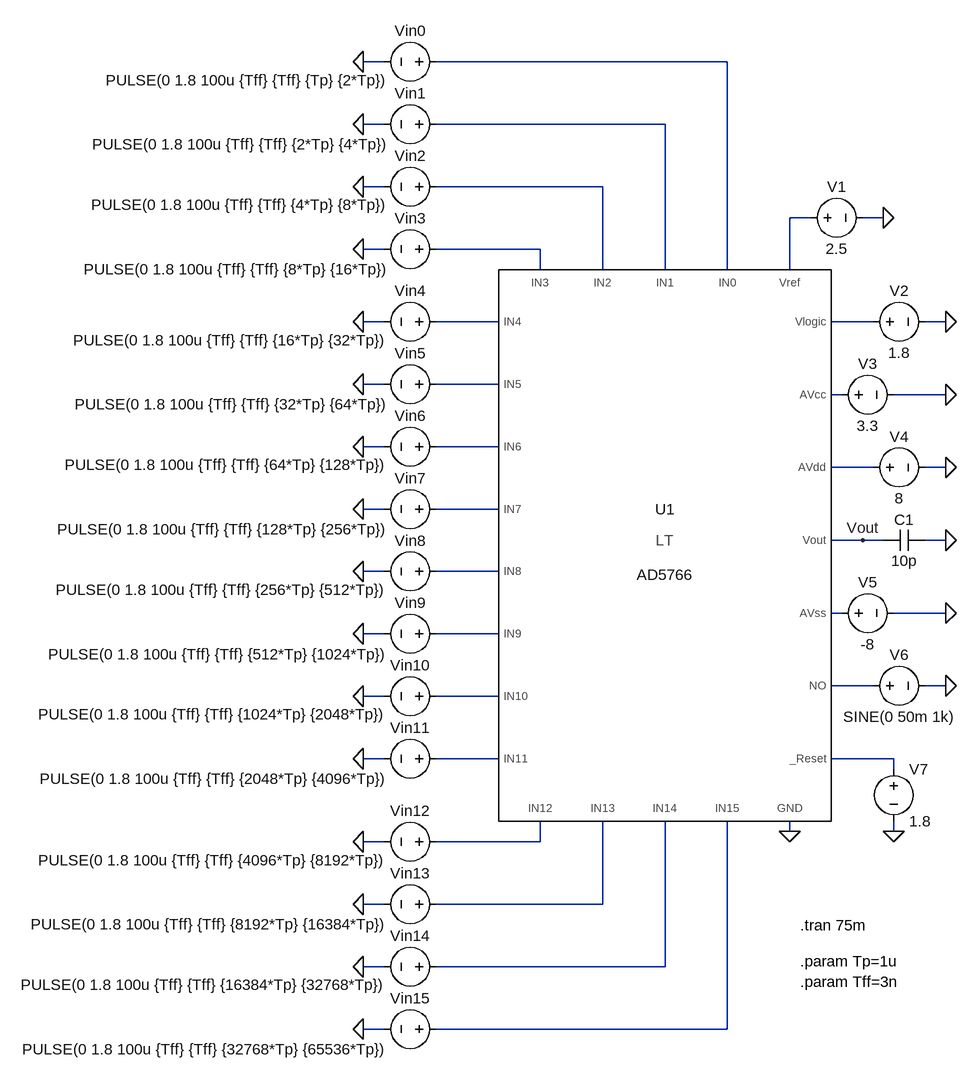
[diagram p0: schematic AD5766.asc]
AD5766.asc, the LTspice schematic file:
Version 4
SHEET 1 2580 1392
WIRE -128 -144 -160 -144
WIRE 400 -144 -48 -144
WIRE -128 -48 -160 -48
WIRE 304 -48 -48 -48
WIRE -128 48 -160 48
WIRE 208 48 -48 48
WIRE 528 96 496 96
WIRE 640 96 608 96
WIRE -128 144 -160 144
WIRE 112 144 -48 144
WIRE 112 176 112 144
WIRE 208 176 208 48
WIRE 304 176 304 -48
WIRE 400 176 400 -144
WIRE 496 176 496 96
WIRE -128 256 -160 256
WIRE 48 256 -48 256
WIRE 624 256 560 256
WIRE 736 256 704 256
WIRE -128 352 -160 352
WIRE 48 352 -48 352
WIRE 576 368 560 368
WIRE 736 368 656 368
WIRE -128 448 -160 448
WIRE 48 448 -48 448
WIRE 624 480 560 480
WIRE 736 480 704 480
WIRE -128 544 -160 544
WIRE 48 544 -48 544
WIRE 608 592 560 592
WIRE 640 592 608 592
WIRE 736 592 704 592
WIRE -128 640 -160 640
WIRE 48 640 -48 640
WIRE 576 704 560 704
WIRE 736 704 656 704
WIRE -128 736 -160 736
WIRE 48 736 -48 736
WIRE 624 816 560 816
WIRE 736 816 704 816
WIRE -128 832 -160 832
WIRE 48 832 -48 832
WIRE -128 928 -160 928
WIRE 48 928 -48 928
WIRE 656 928 560 928
WIRE 656 944 656 928
WIRE 496 1040 496 1024
WIRE 656 1040 656 1024
WIRE -128 1056 -160 1056
WIRE 112 1056 112 1024
WIRE 112 1056 -48 1056
WIRE -128 1152 -160 1152
WIRE 208 1152 208 1024
WIRE 208 1152 -48 1152
WIRE -128 1248 -160 1248
WIRE 304 1248 304 1024
WIRE 304 1248 -48 1248
WIRE -128 1344 -160 1344
WIRE 400 1344 400 1024
WIRE 400 1344 -48 1344
FLAG 496 1040 0
FLAG 640 96 0
FLAG 736 256 0
FLAG -160 -144 0
FLAG 736 592 0
FLAG 608 592 Vout
FLAG -160 -48 0
FLAG -160 48 0
FLAG -160 144 0
FLAG -160 256 0
FLAG -160 352 0
FLAG -160 448 0
FLAG -160 544 0
FLAG -160 640 0
FLAG -160 736 0
FLAG -160 832 0
FLAG -160 928 0
FLAG -160 1056 0
FLAG -160 1152 0
FLAG -160 1248 0
FLAG -160 1344 0
FLAG 736 368 0
FLAG 736 480 0
FLAG 736 704 0
FLAG 736 816 0
FLAG 656 1040 0
SYMBOL voltage 512 96 M90
WINDOW 0 -32 56 VBottom 2
WINDOW 3 32 56 VTop 2
WINDOW 123 74 56 VTop 2
WINDOW 39 53 56 VTop 2
SYMATTR InstName V1
SYMATTR Value 2.5
SYMBOL voltage 608 256 M90
WINDOW 0 -32 56 VBottom 2
WINDOW 3 32 56 VTop 2
WINDOW 123 74 56 VTop 2
WINDOW 39 53 56 VTop 2
SYMATTR InstName V2
SYMATTR Value 1.8
SYMBOL voltage -32 -144 R90
WINDOW 0 -32 56 VBottom 2
WINDOW 3 28 86 VRight 2
SYMATTR InstName Vin0
SYMATTR Value PULSE(0 1.8 100u {Tff} {Tff} {Tp} {2*Tp})
SYMBOL cap 704 576 R90
WINDOW 0 0 32 VBottom 2
WINDOW 3 32 32 VTop 2
SYMATTR InstName C1
SYMATTR Value 10p
SYMBOL AD5766 304 592 R0
SYMATTR InstName U1
SYMBOL voltage -32 -48 R90
WINDOW 0 -32 56 VBottom 2
WINDOW 3 31 84 VRight 2
SYMATTR InstName Vin1
SYMATTR Value PULSE(0 1.8 100u {Tff} {Tff} {2*Tp} {4*Tp})
SYMBOL voltage -32 48 R90
WINDOW 0 -32 56 VBottom 2
WINDOW 3 28 86 VRight 2
SYMATTR InstName Vin2
SYMATTR Value PULSE(0 1.8 100u {Tff} {Tff} {4*Tp} {8*Tp})
SYMBOL voltage -32 144 R90
WINDOW 0 -32 56 VBottom 2
WINDOW 3 31 84 VRight 2
SYMATTR InstName Vin3
SYMATTR Value PULSE(0 1.8 100u {Tff} {Tff} {8*Tp} {16*Tp})
SYMBOL voltage -32 256 R90
WINDOW 0 -32 56 VBottom 2
WINDOW 3 28 86 VRight 2
SYMATTR InstName Vin4
SYMATTR Value PULSE(0 1.8 100u {Tff} {Tff} {16*Tp} {32*Tp})
SYMBOL voltage -32 352 R90
WINDOW 0 -32 56 VBottom 2
WINDOW 3 31 84 VRight 2
SYMATTR InstName Vin5
SYMATTR Value PULSE(0 1.8 100u {Tff} {Tff} {32*Tp} {64*Tp})
SYMBOL voltage -32 448 R90
WINDOW 0 -32 56 VBottom 2
WINDOW 3 28 86 VRight 2
SYMATTR InstName Vin6
SYMATTR Value PULSE(0 1.8 100u {Tff} {Tff} {64*Tp} {128*Tp})
SYMBOL voltage -32 544 R90
WINDOW 0 -32 56 VBottom 2
WINDOW 3 31 84 VRight 2
SYMATTR InstName Vin7
SYMATTR Value PULSE(0 1.8 100u {Tff} {Tff} {128*Tp} {256*Tp})
SYMBOL voltage -32 640 R90
WINDOW 0 -32 56 VBottom 2
WINDOW 3 28 86 VRight 2
SYMATTR InstName Vin8
SYMATTR Value PULSE(0 1.8 100u {Tff} {Tff} {256*Tp} {512*Tp})
SYMBOL voltage -32 736 R90
WINDOW 0 -32 56 VBottom 2
WINDOW 3 31 84 VRight 2
SYMATTR InstName Vin9
SYMATTR Value PULSE(0 1.8 100u {Tff} {Tff} {512*Tp} {1024*Tp})
SYMBOL voltage -32 832 R90
WINDOW 0 -32 56 VBottom 2
WINDOW 3 28 86 VRight 2
SYMATTR InstName Vin10
SYMATTR Value PULSE(0 1.8 100u {Tff} {Tff} {1024*Tp} {2048*Tp})
SYMBOL voltage -32 928 R90
WINDOW 0 -32 56 VBottom 2
WINDOW 3 31 84 VRight 2
SYMATTR InstName Vin11
SYMATTR Value PULSE(0 1.8 100u {Tff} {Tff} {2048*Tp} {4096*Tp})
SYMBOL voltage -32 1056 R90
WINDOW 0 -32 56 VBottom 2
WINDOW 3 28 86 VRight 2
SYMATTR InstName Vin12
SYMATTR Value PULSE(0 1.8 100u {Tff} {Tff} {4096*Tp} {8192*Tp})
SYMBOL voltage -32 1152 R90
WINDOW 0 -32 56 VBottom 2
WINDOW 3 31 84 VRight 2
SYMATTR InstName Vin13
SYMATTR Value PULSE(0 1.8 100u {Tff} {Tff} {8192*Tp} {16384*Tp})
SYMBOL voltage -32 1248 R90
WINDOW 0 -32 56 VBottom 2
WINDOW 3 28 86 VRight 2
SYMATTR InstName Vin14
SYMATTR Value PULSE(0 1.8 100u {Tff} {Tff} {16384*Tp} {32768*Tp})
SYMBOL voltage -32 1344 R90
WINDOW 0 -32 56 VBottom 2
WINDOW 3 31 84 VRight 2
SYMATTR InstName Vin15
SYMATTR Value PULSE(0 1.8 100u {Tff} {Tff} {32768*Tp} {65536*Tp})
SYMBOL voltage 560 368 M90
WINDOW 0 -32 56 VBottom 2
WINDOW 3 32 56 VTop 2
WINDOW 123 74 56 VTop 2
WINDOW 39 53 56 VTop 2
SYMATTR InstName V3
SYMATTR Value 3.3
SYMBOL voltage 608 480 M90
WINDOW 0 -32 56 VBottom 2
WINDOW 3 32 56 VTop 2
WINDOW 123 74 56 VTop 2
WINDOW 39 53 56 VTop 2
SYMATTR InstName V4
SYMATTR Value 8
SYMBOL voltage 560 704 M90
WINDOW 0 -32 56 VBottom 2
WINDOW 3 32 56 VTop 2
WINDOW 123 74 56 VTop 2
WINDOW 39 53 56 VTop 2
SYMATTR InstName V5
SYMATTR Value -8
SYMBOL voltage 608 816 M90
WINDOW 0 -32 56 VBottom 2
WINDOW 3 32 56 VTop 2
WINDOW 123 74 56 VTop 2
WINDOW 39 53 56 VTop 2
SYMATTR InstName V6
SYMATTR Value SINE(0 50m 1k)
SYMBOL voltage 656 928 R0
WINDOW 123 24 138 Left 2
WINDOW 39 24 117 Left 2
SYMATTR InstName V7
SYMATTR Value 1.8
TEXT 512 1184 Left 2 !.tran 75m
TEXT 512 1240 Left 2 !.param Tp=1u\n.param Tff=3n

The netlist it stands for:
* AD5766.asc
V1 N004 0 2.5
V2 N007 0 1.8
Vin0 N001 0 PULSE(0 1.8 100u {Tff} {Tff} {Tp} {2*Tp})
C1 0 Vout 10p
XU1 N001 N002 N003 N005 N006 N008 N010 N012 N013 N015 N017 N018 N020 N021 N022 N023 N007 N011 N014 N009 N016 N004 N019 Vout 0 AD5766  ; pins IN0 IN1 IN2 IN3 IN4 IN5 IN6 IN7 IN8 IN9 IN10 IN11 IN12 IN13 IN14 IN15 Vlogic AVdd AVss AVcc NO Vref _Reset Vout GND
Vin1 N002 0 PULSE(0 1.8 100u {Tff} {Tff} {2*Tp} {4*Tp})
Vin2 N003 0 PULSE(0 1.8 100u {Tff} {Tff} {4*Tp} {8*Tp})
Vin3 N005 0 PULSE(0 1.8 100u {Tff} {Tff} {8*Tp} {16*Tp})
Vin4 N006 0 PULSE(0 1.8 100u {Tff} {Tff} {16*Tp} {32*Tp})
Vin5 N008 0 PULSE(0 1.8 100u {Tff} {Tff} {32*Tp} {64*Tp})
Vin6 N010 0 PULSE(0 1.8 100u {Tff} {Tff} {64*Tp} {128*Tp})
Vin7 N012 0 PULSE(0 1.8 100u {Tff} {Tff} {128*Tp} {256*Tp})
Vin8 N013 0 PULSE(0 1.8 100u {Tff} {Tff} {256*Tp} {512*Tp})
Vin9 N015 0 PULSE(0 1.8 100u {Tff} {Tff} {512*Tp} {1024*Tp})
Vin10 N017 0 PULSE(0 1.8 100u {Tff} {Tff} {1024*Tp} {2048*Tp})
Vin11 N018 0 PULSE(0 1.8 100u {Tff} {Tff} {2048*Tp} {4096*Tp})
Vin12 N020 0 PULSE(0 1.8 100u {Tff} {Tff} {4096*Tp} {8192*Tp})
Vin13 N021 0 PULSE(0 1.8 100u {Tff} {Tff} {8192*Tp} {16384*Tp})
Vin14 N022 0 PULSE(0 1.8 100u {Tff} {Tff} {16384*Tp} {32768*Tp})
Vin15 N023 0 PULSE(0 1.8 100u {Tff} {Tff} {32768*Tp} {65536*Tp})
V3 N009 0 3.3
V4 N011 0 8
V5 N014 0 -8
V6 N016 0 SINE(0 50m 1k)
V7 N019 0 1.8
.tran 75m
.param Tp=1u
.param Tff=3n
.lib AD5766.sub
.backanno
.end